# EAGLE design alimentções (EAGLE 9.0.0)
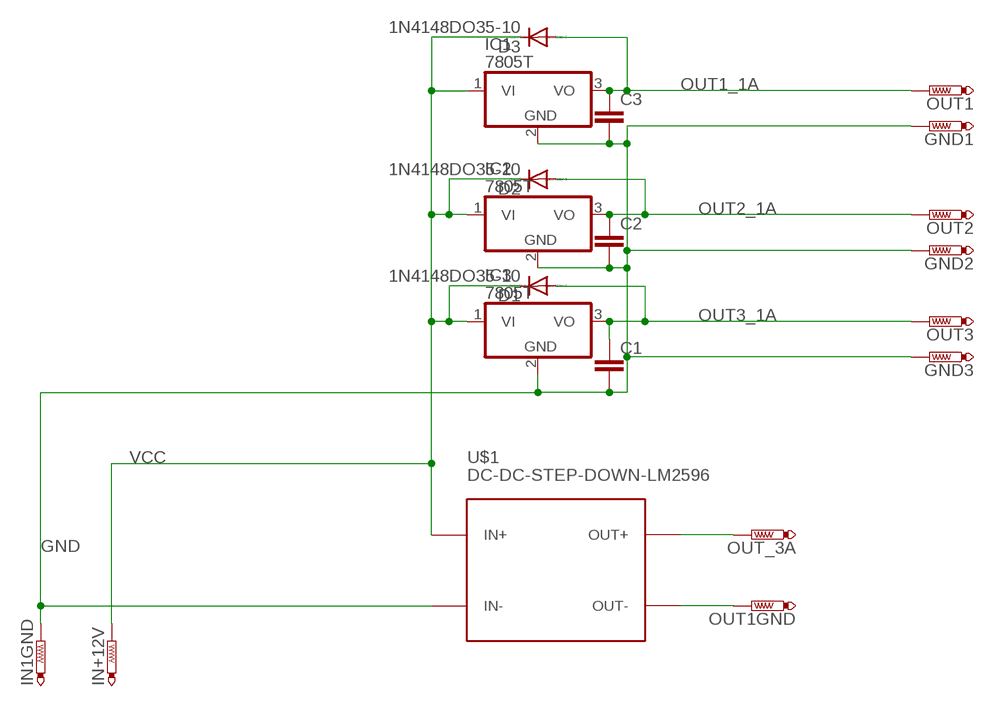
[diagram p0: schematic, sheet 1]

## Parts
C1  C-EU050-035X075  [C050-035X075]
C2  C-EU050-035X075  [C050-035X075]
C3  C-EU050-035X075  [C050-035X075]
D1  1N4148DO35-10  [DO35-10]
D2  1N4148DO35-10  [DO35-10]
D3  1N4148DO35-10  [DO35-10]
GND1  PTR1PAD1-13Y  [P1-13Y]
GND2  PTR1PAD1-13Y  [P1-13Y]
GND3  PTR1PAD1-13Y  [P1-13Y]
IC1  7805T  [TO220H]
IC2  7805T  [TO220H]
IC3  7805T  [TO220H]
IN1GND  PTR1PAD1-13Y  [P1-13Y]
IN+12V  PTR1PAD1-13Y  [P1-13Y]
OUT1  PTR1PAD1-13Y  [P1-13Y]
OUT1GND  PTR1PAD1-13Y  [P1-13Y]
OUT2  PTR1PAD1-13Y  [P1-13Y]
OUT3  PTR1PAD1-13Y  [P1-13Y]
OUT_3A  PTR1PAD1-13Y  [P1-13Y]
U$1  DC-DC-STEP-DOWN-LM2596  [DC-DC-STEP-DOWN-LM2596]

## Nets
GND: C1.2 C2.2 C3.2 GND1.TP GND2.TP GND3.TP IC1.2(GND) IC2.2(GND) IC3.2(GND) IN1GND.TP U$1.IN-
N$2: OUT1GND.TP U$1.OUT-
N$3: OUT_3A.TP U$1.OUT+
OUT1_1A: C3.1 D3.A IC1.3(VO) OUT1.TP
OUT2_1A: C2.1 D2.A IC2.3(VO) OUT2.TP
OUT3_1A: C1.1 D1.A IC3.3(VO) OUT3.TP
VCC: D1.C D2.C D3.C IC1.1(VI) IC2.1(VI) IC3.1(VI) IN+12V.TP U$1.IN+

## Library data of the parts
C1-C3 = rcl:C-EU: CAPACITOR, European symbol; SPICEPREFIX: C
D1-D3 = diode:1N4148: DIODE high speed (Philips)
GND1-GND3 IN1GND IN+12V OUT1 OUT1GND OUT2 OUT3 OUT_3A = testpad:PTR1: TEST PIN
IC1-IC3 = linear:78*: Positive VOLTAGE REGULATOR Source: http://cache.national.com/ds/LM/LM78L05.pdf http://www.fairchildsemi.com/ds/LM/LM7805.pdf
U$1 = diy-modules:DC-DC-STEP-DOWN-LM2596: DC/DC Step-Down Regulator based on LM2596-ADJ chip LM2596 datasheet available here: http://www.ti.com/lit/ds/symlink/lm2596.pdf Click here to find device on ebay.com <http://www.ebay.com/sch/lm2596+power+regulator>

## Board
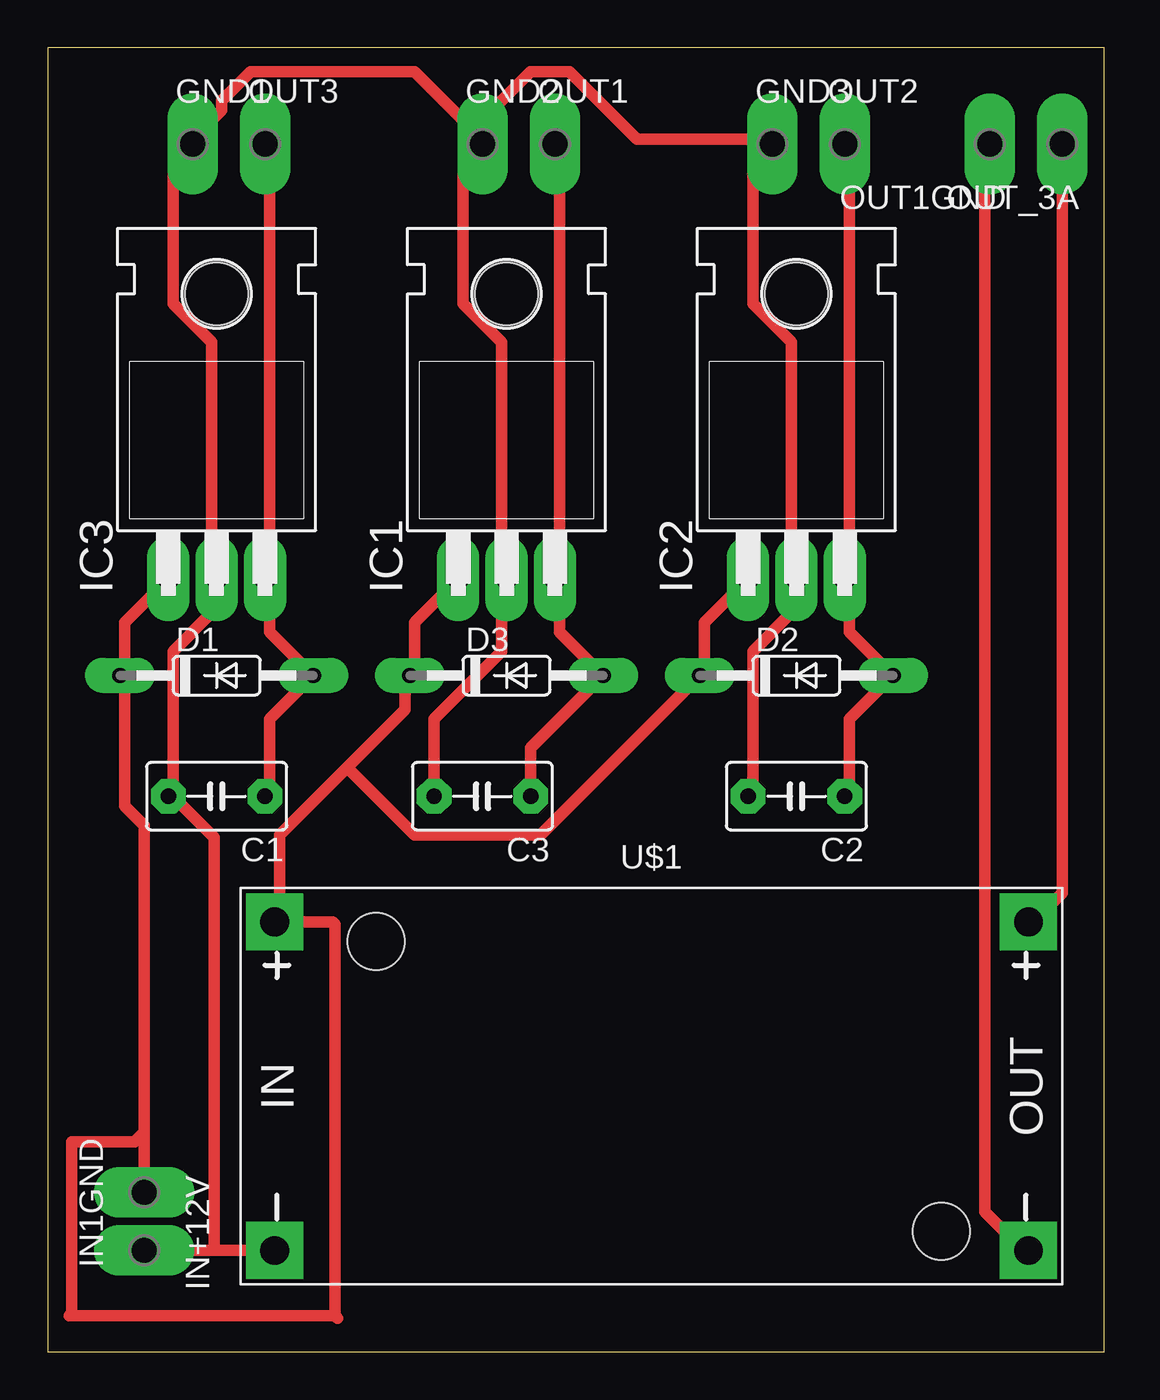
[diagram p1: board, top side]

Size 55.55 x 68.57 mm. Coordinates in mm from the lower left corner, seen from the top.
Outline: 0,0 55.55,0 55.55,68.57 0,68.57 0,0
Copper layers (1*16): Top 0.035mm / dielectric 1.5mm / Bottom 0.035mm
Design rules "LabE": minimum track width 24mil, minimum drill 0.8mm, track to track 16mil, track to pad 16mil, pad to pad 16mil, via to via 16mil, smd to smd 16mil, copper to edge 0mil, drill to drill 16mil, minimum pad ring 20mil, minimum via ring 20mil, stop-mask expansion 4mil, vias tented up to drill 0mil, thermal gap 10mil

### Footprints (pad centres in the part's own frame; a part is rotated, then mirrored left to right if it is on the bottom)
C050-035X075 = drill 0.813 octagon: 1 -2.54,0; 2 2.54,0
DO35-10 = drill 0.813 long: A 5.08,0; C -5.08,0
P1-13Y = drill 1.321 pad 1.905 long: TP 0,0
TO220H = drill 1.118 long: 1 -2.54,-10.16; 2 0,-10.16; 3 2.54,-10.16 | hole 3.302: 0,4.826
DC-DC-STEP-DOWN-LM2596 = drill 1.5 pad 2.5 square: IN+ -19.812,8.636; IN- -19.812,-8.636; OUT+ 19.812,8.636; OUT- 19.812,-8.636 | hole 3: -14.478,7.62; 15.24,-7.62

### Placement (x,y rotation side)
C1  8.89,29.21 180 top
C2  39.37,29.21 180 top
C3  22.86,29.21 180 top
D1  8.89,35.56 0 top
D2  39.37,35.56 0 top
D3  24.13,35.56 0 top
GND1  7.62,63.5 0 top
GND2  22.86,63.5 0 top
GND3  38.1,63.5 0 top
IC1  24.13,50.8 0 top
IC2  39.37,50.8 0 top
IC3  8.89,50.8 0 top
IN1GND  5.08,5.33 90 top
IN+12V  5.08,8.38 270 top
OUT1  26.67,63.5 0 top
OUT1GND  49.53,63.5 180 top
OUT2  41.91,63.5 0 top
OUT3  11.43,63.5 0 top
OUT_3A  53.34,63.5 180 top
U$1  31.75,13.97 0 top

### Tracks (layer width: path | path; a pad name or v marks a point on that pad's centre or on a via)
GND
  Top 0.61: 6.6,29.21 6.6,36.83 8.64,38.86 8.64,40.39 IC3.2 8.64,40.89 8.64,53.09 6.6,55.12 6.6,62.23 7.62,63.25 GND1.TP 7.62,63.75 9.14,65.28 9.14,65.79 10.67,67.31 19.3,67.31 22.35,64.26 | 6.6,29.21 C1.2 | C3.2 20.32,33.27 23.88,36.83 23.88,40.39 IC1.2 23.88,40.89 23.88,53.09 21.84,55.12 21.84,62.23 22.86,63.25 GND2.TP | C2.2 37.08,29.21 37.08,36.83 39.12,38.86 39.12,40.39 IC2.2 39.12,40.89 39.12,53.09 37.08,55.12 37.08,63.75 | 22.35,64.26 22.86,63.75 GND2.TP | 37.08,63.75 30.99,63.75 27.43,67.31 25.4,67.31 22.35,64.26 | 37.08,63.75 38.1,63.75 GND3.TP 37.08,63.75 | 22.35,64.26 GND2.TP | 8.76,5.33 8.76,27.05 6.6,29.21 | 8.76,5.33 U$1.IN- | 8.76,5.33 IN1GND.TP
N$2
  Top 0.61: OUT1GND.TP 49.28,63.25 49.28,7.37 51.31,5.33 U$1.OUT-
N$3
  Top 0.61: OUT_3A.TP 53.34,24.13 51.82,22.61 U$1.OUT+
OUT1_1A
  Top 0.61: C3.1 25.4,31.75 D3.A 26.92,37.85 26.92,40.39 IC1.3 26.92,40.89 26.92,63.25 OUT1.TP
OUT2_1A
  Top 0.61: C2.1 42.16,29.21 42.16,33.27 D2.A 42.16,37.85 42.16,40.39 IC2.3 42.16,40.89 42.16,63.25 OUT2.TP
OUT3_1A
  Top 0.61: C1.1 11.68,29.21 11.68,33.27 D1.A 11.68,37.85 11.68,40.39 IC3.3 11.68,40.89 11.68,63.25 OUT3.TP
VCC
  Top 0.61: IC3.1 4.06,38.35 4.06,35.81 D1.C 4.06,35.31 4.06,28.7 5.08,27.69 5.08,14.99 5.08,11.56 | IC2.1 34.54,38.35 34.54,35.81 D2.C 25.91,27.18 19.3,27.18 15.75,30.73 | IC1.1 19.3,38.35 19.3,35.81 D3.C 18.8,35.31 18.8,33.78 15.75,30.73 | 15.75,30.73 12.19,27.18 12.19,22.61 U$1.IN+ | 5.08,11.56 IN+12V.TP | 11.68,22.61 U$1.IN+ | 5.08,11.56 4.57,11.05 1.27,11.05 1.27,2.03 1.14,1.91 15.11,1.91 | 15.24,1.78 15.11,1.91 | 15.11,1.91 15.11,22.48 14.99,22.61 U$1.IN+